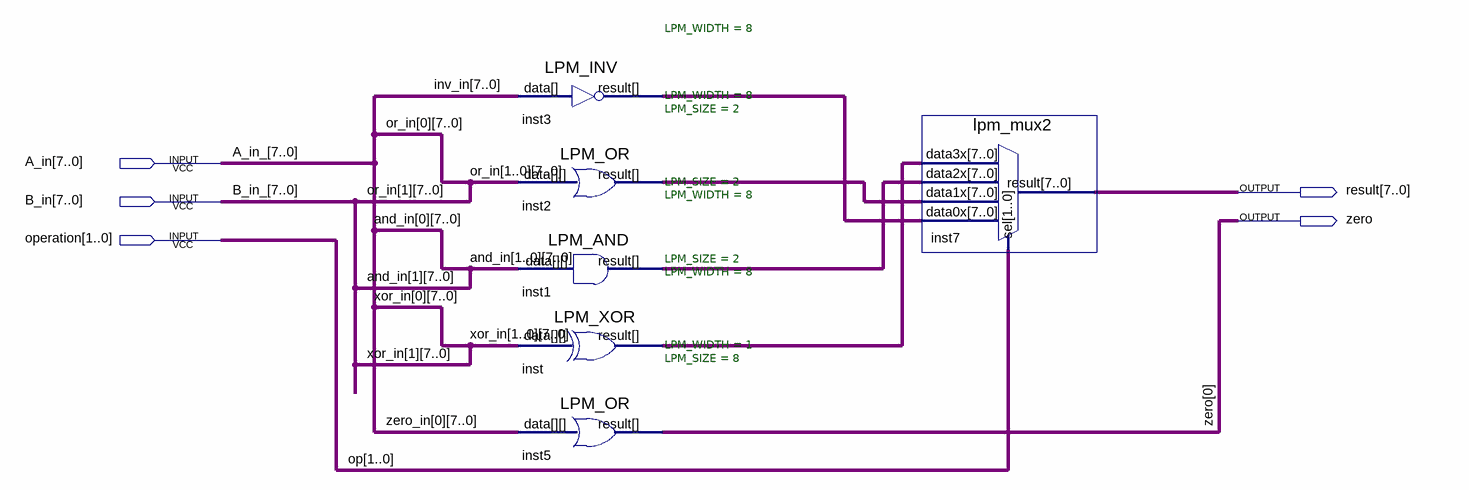
[diagram p0: schematic sheet]
// Quartus schematic bitwiseBlock.bdf as structural Verilog: 6 symbols, 5 pins
module bitwiseBlock (
  input  [7:0] A_in,
  input  [7:0] B_in,
  input  [1:0] operation,
  output [7:0] result,
  output zero
);

  wire [7:0] and_in_0, and_in_1, inst1_result, inst2_result, inst3_result, inst_result, inv_in, or_in_0,
       or_in_1, xor_in_0, xor_in_1, zero_in_0;

  LPM_INV #(.LPM_WIDTH(8)) inst3 (.data(inv_in), .result(inst3_result));
  LPM_OR #(.LPM_WIDTH(8), .LPM_SIZE(2)) inst2 (.data({or_in_1, or_in_0}), .result(inst2_result));
  LPM_AND #(.LPM_SIZE(2), .LPM_WIDTH(8)) inst1 (.data({and_in_1, and_in_0}), .result(inst1_result));
  LPM_XOR #(.LPM_SIZE(2), .LPM_WIDTH(8)) inst (.data({xor_in_1, xor_in_0}), .result(inst_result));
  LPM_OR #(.LPM_WIDTH(1), .LPM_SIZE(8)) inst5 (.data(zero_in_0), .result(zero));
  lpm_mux2 inst7 (
    .data3x(inst_result), .data2x(inst1_result), .data1x(inst2_result), .data0x(inst3_result),
    .sel(operation), .result(result));

  // Other names for the same wires on the sheet: A_in_[7:0] = A_in; B_in_[7:0] = B_in; op[1:0] = operation;
  //   zero[0] = zero
endmodule
